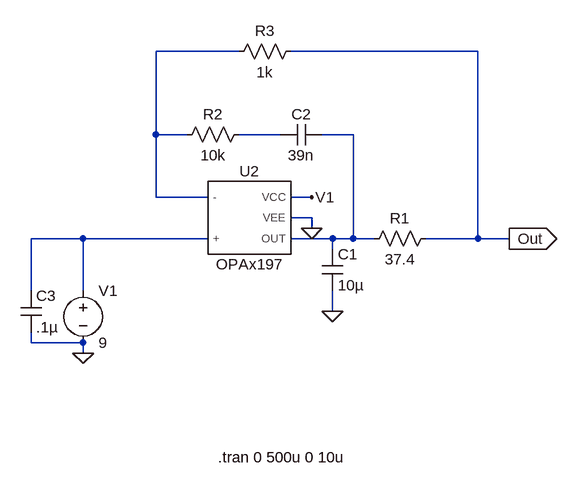
[diagram p0: schematic RefAmp197.asc]
RefAmp197.asc, the LTspice schematic file:
Version 4
SHEET 1 880 680
WIRE 240 -224 112 -224
WIRE 608 -224 320 -224
WIRE 112 -96 112 -224
WIRE 160 -96 112 -96
WIRE 304 -96 240 -96
WIRE 416 -96 368 -96
WIRE 112 0 112 -96
WIRE 192 0 112 0
WIRE 352 0 320 0
WIRE 352 32 320 32
WIRE 352 48 352 32
WIRE 0 64 -80 64
WIRE 192 64 0 64
WIRE 384 64 320 64
WIRE 416 64 416 -96
WIRE 416 64 384 64
WIRE 448 64 416 64
WIRE 608 64 608 -224
WIRE 608 64 528 64
WIRE 656 64 608 64
WIRE 384 80 384 64
WIRE -80 144 -80 64
WIRE 0 144 0 64
WIRE 384 176 384 144
WIRE -80 224 -80 208
WIRE 0 224 -80 224
WIRE 0 240 0 224
FLAG 0 240 0
FLAG 352 48 0
FLAG 656 64 Out
IOPIN 656 64 Out
FLAG 384 176 0
FLAG 352 0 V1
SYMBOL voltage 0 128 R0
WINDOW 39 0 0 Left 0
SYMATTR Value2 AC 0
SYMATTR InstName V1
SYMATTR Value 9
SYMBOL OPAx197 256 32 R0
SYMATTR InstName U2
SYMBOL cap 368 80 R0
SYMATTR InstName C1
SYMATTR Value 10µ
SYMBOL res 544 48 R90
WINDOW 0 0 56 VBottom 2
WINDOW 3 32 56 VTop 2
SYMATTR InstName R1
SYMATTR Value 37.4
SYMBOL cap 368 -112 R90
WINDOW 0 0 32 VBottom 2
WINDOW 3 32 32 VTop 2
SYMATTR InstName C2
SYMATTR Value 39n
SYMBOL res 256 -112 R90
WINDOW 0 0 56 VBottom 2
WINDOW 3 32 56 VTop 2
SYMATTR InstName R2
SYMATTR Value 10k
SYMBOL res 336 -240 R90
WINDOW 0 0 56 VBottom 2
WINDOW 3 32 56 VTop 2
SYMATTR InstName R3
SYMATTR Value 1k
SYMBOL cap -96 144 R0
SYMATTR InstName C3
SYMATTR Value .1µ
TEXT 208 400 Left 2 !.tran 0 500u 0 10u

The netlist it stands for:
* RefAmp197.asc
V1 N004 0 9 AC 0
XU2 N004 N001 V1 0 N003 OPAx197  ; pins + - VCC VEE OUT
C1 N003 0 10µ
R1 Out N003 37.4
C2 N003 N002 39n
R2 N002 N001 10k
R3 Out N001 1k
C3 N004 0 .1µ
.tran 0 500u 0 10u
.lib C:\Users\bismi\OneDrive\Documents\Senior Design\Spice Models\OPAx197.LIB
.backanno
.end